# EAGLE schematic GrblMainboard - v2.2 (EAGLE 6.3)
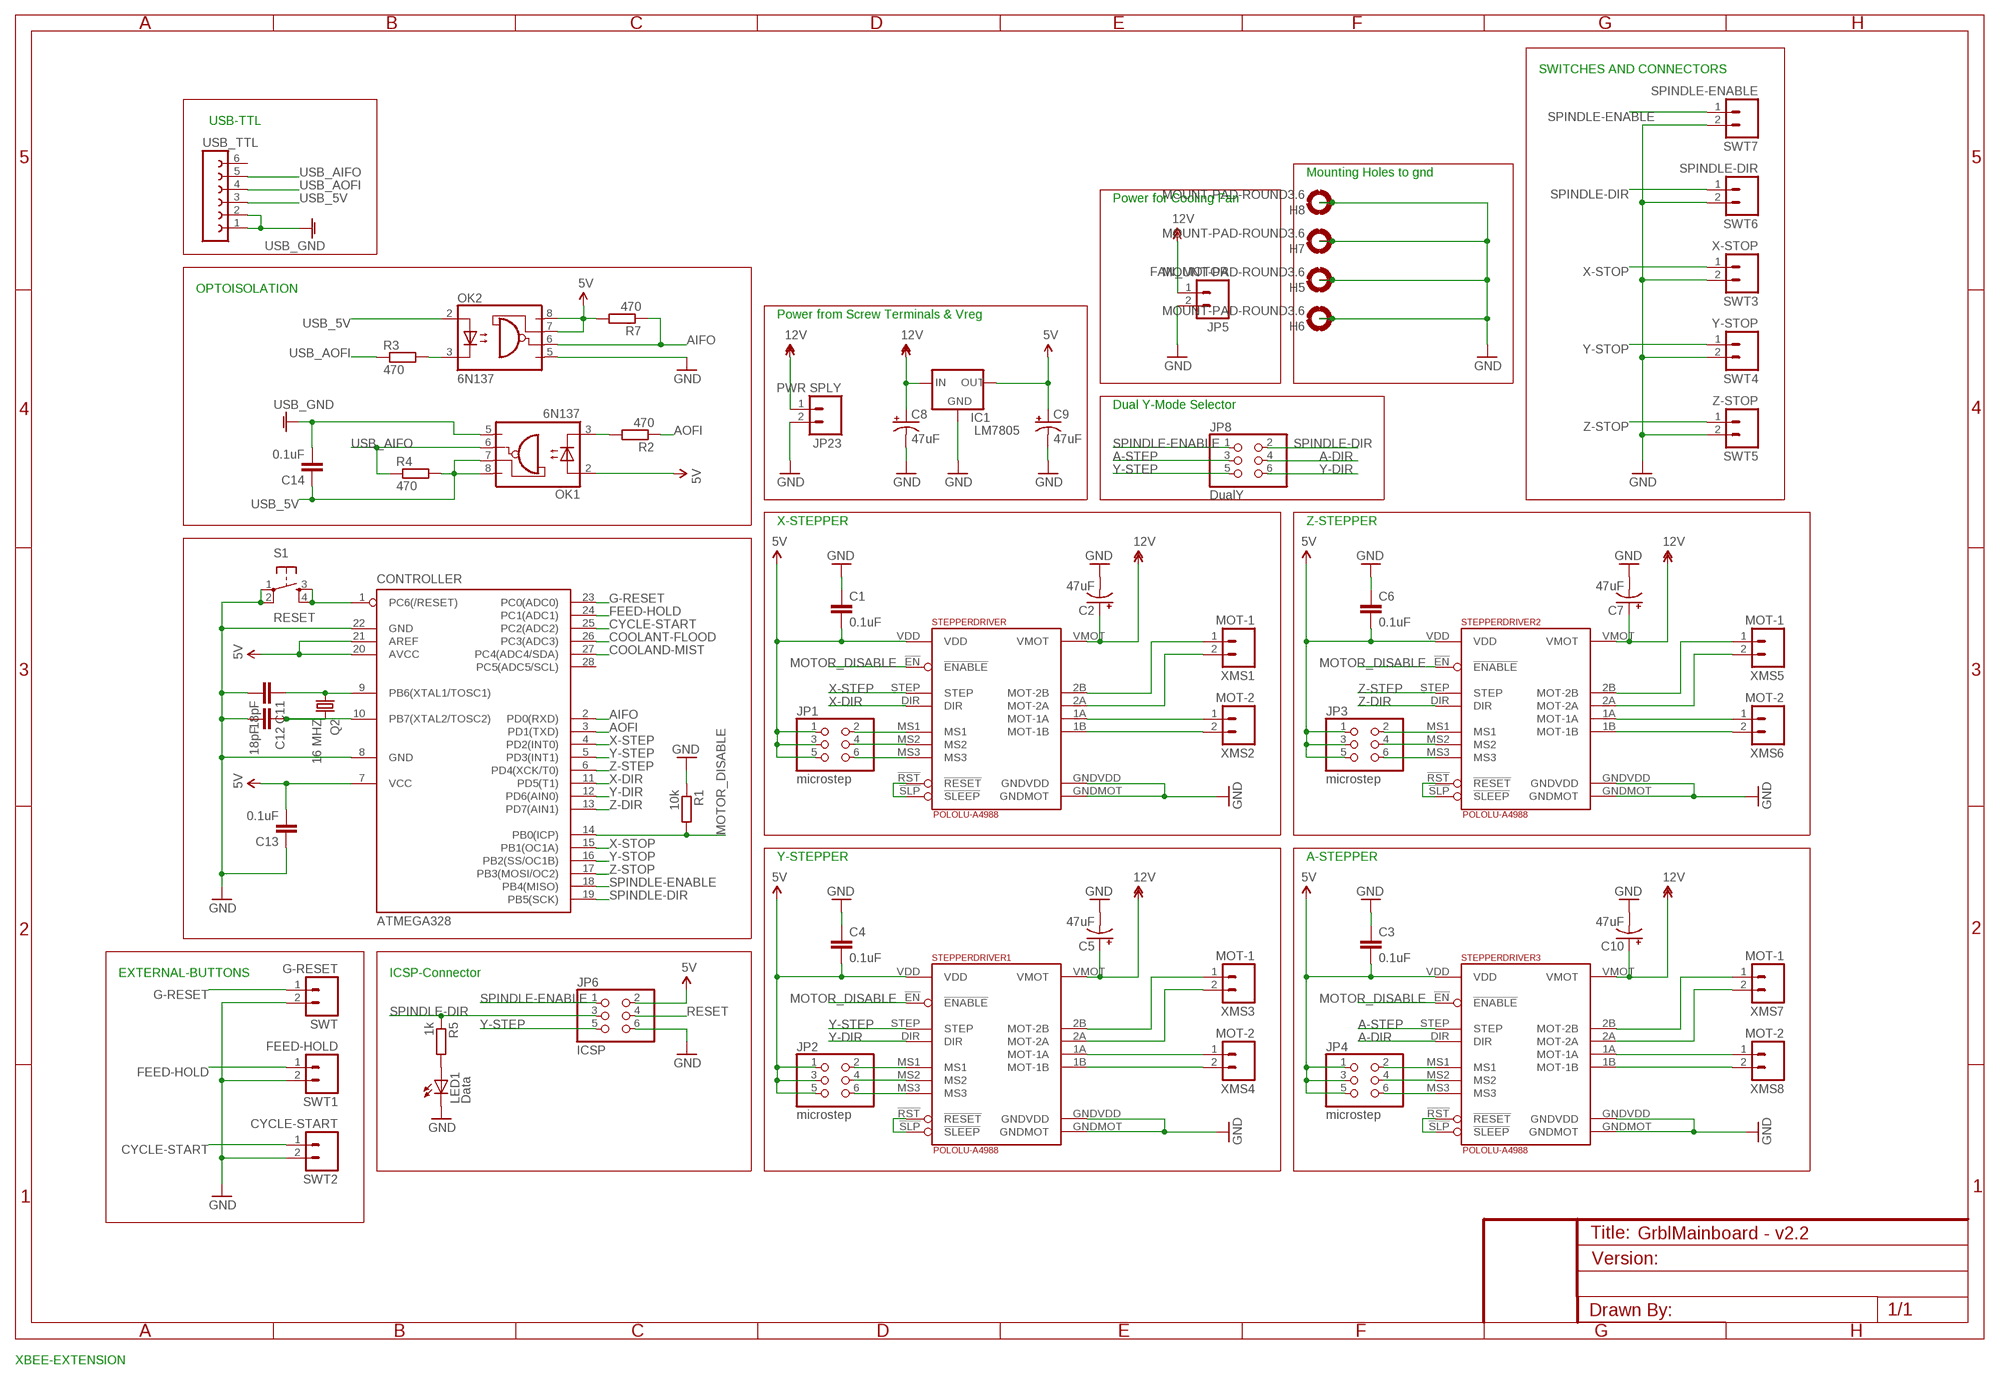
[diagram p0: schematic, sheet 1]

## Parts
ATMEGA328  CONTROLLER  MEGA8-P  [DIL28-3]
C1  0.1uF  C-EU025-025X050  [C025-025X050]
C2  47uF  CPOL-USE2.5-6  [E2,5-6]
C3  0.1uF  C-EU025-025X050  [C025-025X050]
C4  0.1uF  C-EU025-025X050  [C025-025X050]
C5  47uF  CPOL-USE2.5-6  [E2,5-6]
C6  0.1uF  C-EU025-025X050  [C025-025X050]
C7  47uF  CPOL-USE2.5-6  [E2,5-6]
C8  47uF  CPOL-USE2.5-6  [E2,5-6]
C9  47uF  CPOL-USE2.5-6  [E2,5-6]
C10  47uF  CPOL-USE2.5-6  [E2,5-6]
C11  18pF  CAPPTH2  [CAP-PTH-SMALL2]
C12  18pF  CAPPTH2  [CAP-PTH-SMALL2]
C13  0.1uF  CAPPTH2  [CAP-PTH-SMALL2]
C14  0.1uF  CAPPTH2  [CAP-PTH-SMALL2]
H5  MOUNT-PAD-ROUND3.6  [3,6-PAD]
H6  MOUNT-PAD-ROUND3.6  [3,6-PAD]
H7  MOUNT-PAD-ROUND3.6  [3,6-PAD]
H8  MOUNT-PAD-ROUND3.6  [3,6-PAD]
IC1  LM7805  V_REG_78XX  [78XXL-CUSTOM]
JP1  microstep  PINHD-2X3  [2X03]
JP2  microstep  PINHD-2X3  [2X03]
JP3  microstep  PINHD-2X3  [2X03]
JP4  microstep  PINHD-2X3  [2X03]
JP5  FAN_MOTOR  M025MM  [SCREWTERMINAL-5MM-2]
JP6  ICSP  PINHD-2X3  [2X03]
JP8  DualY  PINHD-2X3  [2X03]
JP23  PWR SPLY  M025MM  [SCREWTERMINAL-5MM-2]
LED1  Data  LED5MM  [LED5MM]
OK1  6N137  [DIL08]
OK2  6N137  [DIL08]
Q2  16 MHZ  CRYSTALHC49S  [HC49/S]
R1  10k  R-EU_0207/10  [0207/10]
R2  470  R-EU_0207/12  [0207/12]
R3  470  R-EU_0207/12  [0207/12]
R4  470  R-EU_0207/12  [0207/12]
R5  1k  R-EU_0207/10  [0207/10]
R7  470  R-EU_0207/12  [0207/12]
S1  RESET  TAC_SWITCHPTH  [TACTILE-PTH]
STEPPERDRIVER  POLOLU-A4988  POLOLU-ALLEGRO  [POLOLU-ALLEGRO-PTH]
STEPPERDRIVER1  POLOLU-A4988  POLOLU-ALLEGRO  [POLOLU-ALLEGRO-PTH]
STEPPERDRIVER2  POLOLU-A4988  POLOLU-ALLEGRO  [POLOLU-ALLEGRO-PTH]
STEPPERDRIVER3  POLOLU-A4988  POLOLU-ALLEGRO  [POLOLU-ALLEGRO-PTH]
SWT  G-RESET  M025MM  [SCREWTERMINAL-5MM-2]
SWT1  FEED-HOLD  M025MM  [SCREWTERMINAL-5MM-2]
SWT2  CYCLE-START  M025MM  [SCREWTERMINAL-5MM-2]
SWT3  X-STOP  M025MM  [SCREWTERMINAL-5MM-2]
SWT4  Y-STOP  M025MM  [SCREWTERMINAL-5MM-2]
SWT5  Z-STOP  M025MM  [SCREWTERMINAL-5MM-2]
SWT6  SPINDLE-DIR  M025MM  [SCREWTERMINAL-5MM-2]
SWT7  SPINDLE-ENABLE  M025MM  [SCREWTERMINAL-5MM-2]
USB_TTL  FE06-1  [FE06]
XMS1  MOT-1  M025MM  [SCREWTERMINAL-5MM-2]
XMS2  MOT-2  M025MM  [SCREWTERMINAL-5MM-2]
XMS3  MOT-1  M025MM  [SCREWTERMINAL-5MM-2]
XMS4  MOT-2  M025MM  [SCREWTERMINAL-5MM-2]
XMS5  MOT-1  M025MM  [SCREWTERMINAL-5MM-2]
XMS6  MOT-2  M025MM  [SCREWTERMINAL-5MM-2]
XMS7  MOT-1  M025MM  [SCREWTERMINAL-5MM-2]
XMS8  MOT-2  M025MM  [SCREWTERMINAL-5MM-2]

## Nets
5V: ATMEGA328.7(VCC) ATMEGA328.20(AVCC) ATMEGA328.21(AREF) C1.2 C3.2 C4.2 C6.2 C9.+ C13.2 IC1.OUT JP1.1 JP1.3 JP1.5 JP2.1 JP2.3 JP2.5 JP3.1 JP3.3 JP3.5 JP4.1 JP4.3 JP4.5 JP6.2 OK1.2(A) OK2.7(VE) OK2.8(VCC) R7.2 STEPPERDRIVER1.VDD STEPPERDRIVER2.VDD STEPPERDRIVER3.VDD STEPPERDRIVER.VDD
12V: C2.+ C5.+ C7.+ C8.+ C10.+ IC1.IN JP5.1 JP23.1 STEPPERDRIVER1.VMOT STEPPERDRIVER2.VMOT STEPPERDRIVER3.VMOT STEPPERDRIVER.VMOT
A-DIR: JP8.4 STEPPERDRIVER3.DIR
A-STEP: JP8.3 STEPPERDRIVER3.STEP
AIFO: ATMEGA328.2(PD0(RXD)) OK2.6(VO) R7.1
AOFI: ATMEGA328.3(PD1(TXD)) R2.1
COOLAND-MIST: ATMEGA328.27(PC4(ADC4/SDA))
COOLANT-FLOOD: ATMEGA328.26(PC3(ADC3))
CYCLE-START: ATMEGA328.25(PC2(ADC2)) SWT2.1
FEED-HOLD: ATMEGA328.24(PC1(ADC1)) SWT1.1
G-RESET: ATMEGA328.23(PC0(ADC0)) SWT.1
GND: ATMEGA328.8(GND) ATMEGA328.22(GND) C1.1 C2.- C3.1 C4.1 C5.- C6.1 C7.- C8.- C9.- C10.- C11.2 C12.2 C13.1 H5.B3,6(MOUNT) H6.B3,6(MOUNT) H7.B3,6(MOUNT) H8.B3,6(MOUNT) IC1.GND JP5.2 JP6.6 JP23.2 LED1.K(C) OK2.5(GND) R1.1 S1.1 S1.2 STEPPERDRIVER1.GNDMOT STEPPERDRIVER1.GNDVDD STEPPERDRIVER2.GNDMOT STEPPERDRIVER2.GNDVDD STEPPERDRIVER3.GNDMOT STEPPERDRIVER3.GNDVDD STEPPERDRIVER.GNDMOT STEPPERDRIVER.GNDVDD SWT1.2 SWT2.2 SWT3.2 SWT4.2 SWT5.2 SWT6.2 SWT7.2 SWT.2
GNDA: C14.2 OK1.5(GND) USB_TTL.1 USB_TTL.2 ; supply symbol labelled USB_GND
MOTOR_DISABLE: ATMEGA328.14(PB0(ICP)) R1.2 STEPPERDRIVER1.!EN(!ENABLE) STEPPERDRIVER2.!EN(!ENABLE) STEPPERDRIVER3.!EN(!ENABLE) STEPPERDRIVER.!EN(!ENABLE)
N$1: STEPPERDRIVER.2B(MOT-2B) XMS1.1
N$2: STEPPERDRIVER.2A(MOT-2A) XMS1.2
N$3: STEPPERDRIVER.1A(MOT-1A) XMS2.1
N$4: STEPPERDRIVER.1B(MOT-1B) XMS2.2
N$5: STEPPERDRIVER.!RST(!RESET) STEPPERDRIVER.!SLP(!SLEEP)
N$6: JP1.2 STEPPERDRIVER.MS1
N$7: JP1.4 STEPPERDRIVER.MS2
N$8: JP1.6 STEPPERDRIVER.MS3
N$9: STEPPERDRIVER1.2B(MOT-2B) XMS3.1
N$10: STEPPERDRIVER1.2A(MOT-2A) XMS3.2
N$11: STEPPERDRIVER1.1A(MOT-1A) XMS4.1
N$12: STEPPERDRIVER1.1B(MOT-1B) XMS4.2
N$13: STEPPERDRIVER1.!RST(!RESET) STEPPERDRIVER1.!SLP(!SLEEP)
N$14: JP2.2 STEPPERDRIVER1.MS1
N$15: JP2.4 STEPPERDRIVER1.MS2
N$16: JP2.6 STEPPERDRIVER1.MS3
N$17: STEPPERDRIVER2.2B(MOT-2B) XMS5.1
N$18: STEPPERDRIVER2.2A(MOT-2A) XMS5.2
N$19: STEPPERDRIVER2.1A(MOT-1A) XMS6.1
N$20: STEPPERDRIVER2.1B(MOT-1B) XMS6.2
N$21: STEPPERDRIVER2.!RST(!RESET) STEPPERDRIVER2.!SLP(!SLEEP)
N$22: JP3.2 STEPPERDRIVER2.MS1
N$23: JP3.4 STEPPERDRIVER2.MS2
N$24: JP3.6 STEPPERDRIVER2.MS3
N$25: STEPPERDRIVER3.2B(MOT-2B) XMS7.1
N$26: STEPPERDRIVER3.2A(MOT-2A) XMS7.2
N$27: STEPPERDRIVER3.1A(MOT-1A) XMS8.1
N$28: STEPPERDRIVER3.1B(MOT-1B) XMS8.2
N$29: STEPPERDRIVER3.!RST(!RESET) STEPPERDRIVER3.!SLP(!SLEEP)
N$30: JP4.2 STEPPERDRIVER3.MS1
N$31: JP4.4 STEPPERDRIVER3.MS2
N$32: JP4.6 STEPPERDRIVER3.MS3
N$33: ATMEGA328.9(PB6(XTAL1/TOSC1)) C11.1 Q2.1
N$34: ATMEGA328.10(PB7(XTAL2/TOSC2)) C12.1 Q2.2
N$35: OK2.3(C) R3.2
N$36: OK1.3(C) R2.2
N$37: LED1.A R5.2
RESET: ATMEGA328.1(PC6(/RESET)) JP6.4 S1.3 S1.4
SPINDLE-DIR: ATMEGA328.19(PB5(SCK)) JP6.3 JP8.2 R5.1 SWT6.1
SPINDLE-ENABLE: ATMEGA328.18(PB4(MISO)) JP6.1 JP8.1 SWT7.1
USB_5V: C14.1 OK1.7(VE) OK1.8(VCC) OK2.2(A) R4.2 USB_TTL.3
USB_AIFO: OK1.6(VO) R4.1 USB_TTL.5
USB_AOFI: R3.1 USB_TTL.4
X-DIR: ATMEGA328.11(PD5(T1)) STEPPERDRIVER.DIR
X-STEP: ATMEGA328.4(PD2(INT0)) STEPPERDRIVER.STEP
X-STOP: ATMEGA328.15(PB1(OC1A)) SWT3.1
Y-DIR: ATMEGA328.12(PD6(AIN0)) JP8.6 STEPPERDRIVER1.DIR
Y-STEP: ATMEGA328.5(PD3(INT1)) JP6.5 JP8.5 STEPPERDRIVER1.STEP
Y-STOP: ATMEGA328.16(PB2(SS/OC1B)) SWT4.1
Z-DIR: ATMEGA328.13(PD7(AIN1)) STEPPERDRIVER2.DIR
Z-STEP: ATMEGA328.6(PD4(XCK/T0)) STEPPERDRIVER2.STEP
Z-STOP: ATMEGA328.17(PB3(MOSI/OC2)) SWT5.1
Unconnected: ATMEGA328.28(PC5(ADC5/SCL)) USB_TTL.6

## Notes on the sheet
- SWITCHES AND CONNECTORS
- USB-TTL
- Mounting Holes to gnd
- Power for Cooling Fan
- OPTOISOLATION
- Power from Screw Terminals & Vreg
- Dual Y-Mode Selector
- X-STEPPER | Z-STEPPER
- Y-STEPPER | A-STEPPER
- EXTERNAL-BUTTONS | ICSP-Connector
- XBEE-EXTENSION

## Library data of the parts
ATMEGA328 = Bibsatmel:MEGA8-P: MICROCONTROLLER 8 Kbytes FLASH, 1 kbytes SRAM, 512 bytes EEPROM, USART, 4-channel 10 bit ADC, 2-channel 8 bit ADC Pin compatible with Atmega48, ATMega88, ATMega168 Source: avr.lbr; OC_FARNELL: unknown; OC_NEWARK: unknown
C1 C3 C4 C6 = resistor:C-EU: CAPACITOR, European symbol
C2 C5 C7-C10 = resistor:CPOL-US: POLARIZED CAPACITOR, American symbol
C11-C14 = SparkFun:CAP: Capacitor Standard 0603 ceramic capacitor, and 0.1" leaded capacitor.
H5-H8 = holes:MOUNT-PAD-ROUND: MOUNTING PAD, round
IC1 = SparkFun:V_REG_78XX: Voltage Regulator Standard 7805 5V regulator. IGO (Input Ground Output). Spark Fun Electronics SKU : COM-00107
JP1-JP4 JP6 JP8 = pinhead:PINHD-2X3: PIN HEADER
JP5 JP23 SWT SWT1-SWT7 XMS1-XMS8 = SparkFun:M02: Header 2 Standard 2-pin 0.1" header. Use with straight break away headers (SKU : PRT-00116), right angle break away headers (PRT-00553), swiss pins (PRT-00743), machine pins (PRT-00117), and female headers (PRT-00115). Molex polarized connector foot print use with SKU : PRT-08233 with associated crimp pins and housings.
LED1 = led:LED: LED OSRAM: - CHIPLED LG R971, LG N971, LY N971, LG Q971, LY Q971, LO R971, LY R971 LH N974, LH R974 LS Q976, LO Q976, LY Q976 LO Q996 - Hyper CHIPLED LW Q18S LB Q993, LB Q99A, LB R99A - SideLED LS A670, LO A670, LY A670, LG A670, LP A670 LB A673, LV A673, LT A673, LW A673 LH A674 LY A675 LS A676, LA A676, LO A676, LY A676, LW A676 LS A679, LY A679, LG A679 - Hyper Micro SIDELED® LS Y876, LA Y876, LO Y876, LY Y876 LT Y87S - SmartLED LW L88C, LW L88S LB L89C, LB L89S, LG L890 LS L89K, LO L89K, LY L89K LS L896, LA L896, LO L896, LY L896 - TOPLED LS T670, LO T670, LY T670, LG T670, LP T670 LSG T670, LSP T670, LSY T670, LOP T670, LYG T670 LG T671, LOG T671, LSG T671 LB T673, LV T673, LT T673, LW T673 LH T674 LS T676, LA T676, LO T676, LY T676, LB T676, LH T676, LSB T676, LW T676 LB T67C, LV T67C, LT T67C, LS T67K, LO T67K, LY T67K, LW E67C LS E67B, LA E67B, LO E67B, LY E67B, LB E67C, LV E67C, LT E67C LW T67C LS T679, LY T679, LG T679 LS T770, LO T770, LY T770, LG T770, LP T770 LB T773, LV T773, LT T773, LW T773 LH T774 LS E675, LA E675, LY E675, LS T675 LS T776, LA T776, LO T776, LY T776, LB T776 LHGB T686 LT T68C, LB T68C - Hyper Mini TOPLED® LB M676 - Mini TOPLED Santana® LG M470 LS M47K, LO M47K, LY M47K Source: http://www.osram.convergy.de LUXEON: - LUMILED® LXK2-PW12-R00, LXK2-PW12-S00, LXK2-PW14-U00, LXK2-PW14-V00 LXK2-PM12-R00, LXK2-PM12-S00, LXK2-PM14-U00 LXK2-PE12-Q00, LXK2-PE12-R00, LXK2-PE12-S00, LXK2-PE14-T00, LXK2-PE14-U00 LXK2-PB12-K00, LXK2-PB12-L00, LXK2-PB12-M00, LXK2-PB14-N00, LXK2-PB14-P00, LXK2-PB14-Q00 LXK2-PR12-L00, LXK2-PR12-M00, LXK2-PR14-Q00, LXK2-PR14-R00 LXK2-PD12-Q00, LXK2-PD12-R00, LXK2-PD12-S00 LXK2-PH12-R00, LXK2-PH12-S00 LXK2-PL12-P00, LXK2-PL12-Q00, LXK2-PL12-R00 Source: www.luxeon.com KINGBRIGHT: KA-3528ASYC Source: www.kingbright.com
OK1 OK2 = optocoupler:6N137: MOTOROLA OPTO COUPLER; MPN: 6N137; OC_FARNELL: 1328376; OC_NEWARK: 52M1895
Q2 = crystal:CRYSTAL: CRYSTAL; OC_FARNELL: 1667008; OC_NEWARK: unknown
R1-R5 R7 = resistor:R-EU_: RESISTOR, European symbol
S1 = SparkFun:TAC_SWITCH: Momentary Switch Button commonly used for reset or general input. Spark Fun Electronics SKU : COM-00097
STEPPERDRIVER STEPPERDRIVER1-STEPPERDRIVER3 = pololu-allegro:POLOLU-ALLEGRO
USB_TTL = con-lsta:FE06-1: FEMALE HEADER; OC_FARNELL: unknown; OC_NEWARK: unknown